# EasyEDA Pro project 21届智能车+蚂蚁搬家+主驱一体PCB文件.epro, board PCB3
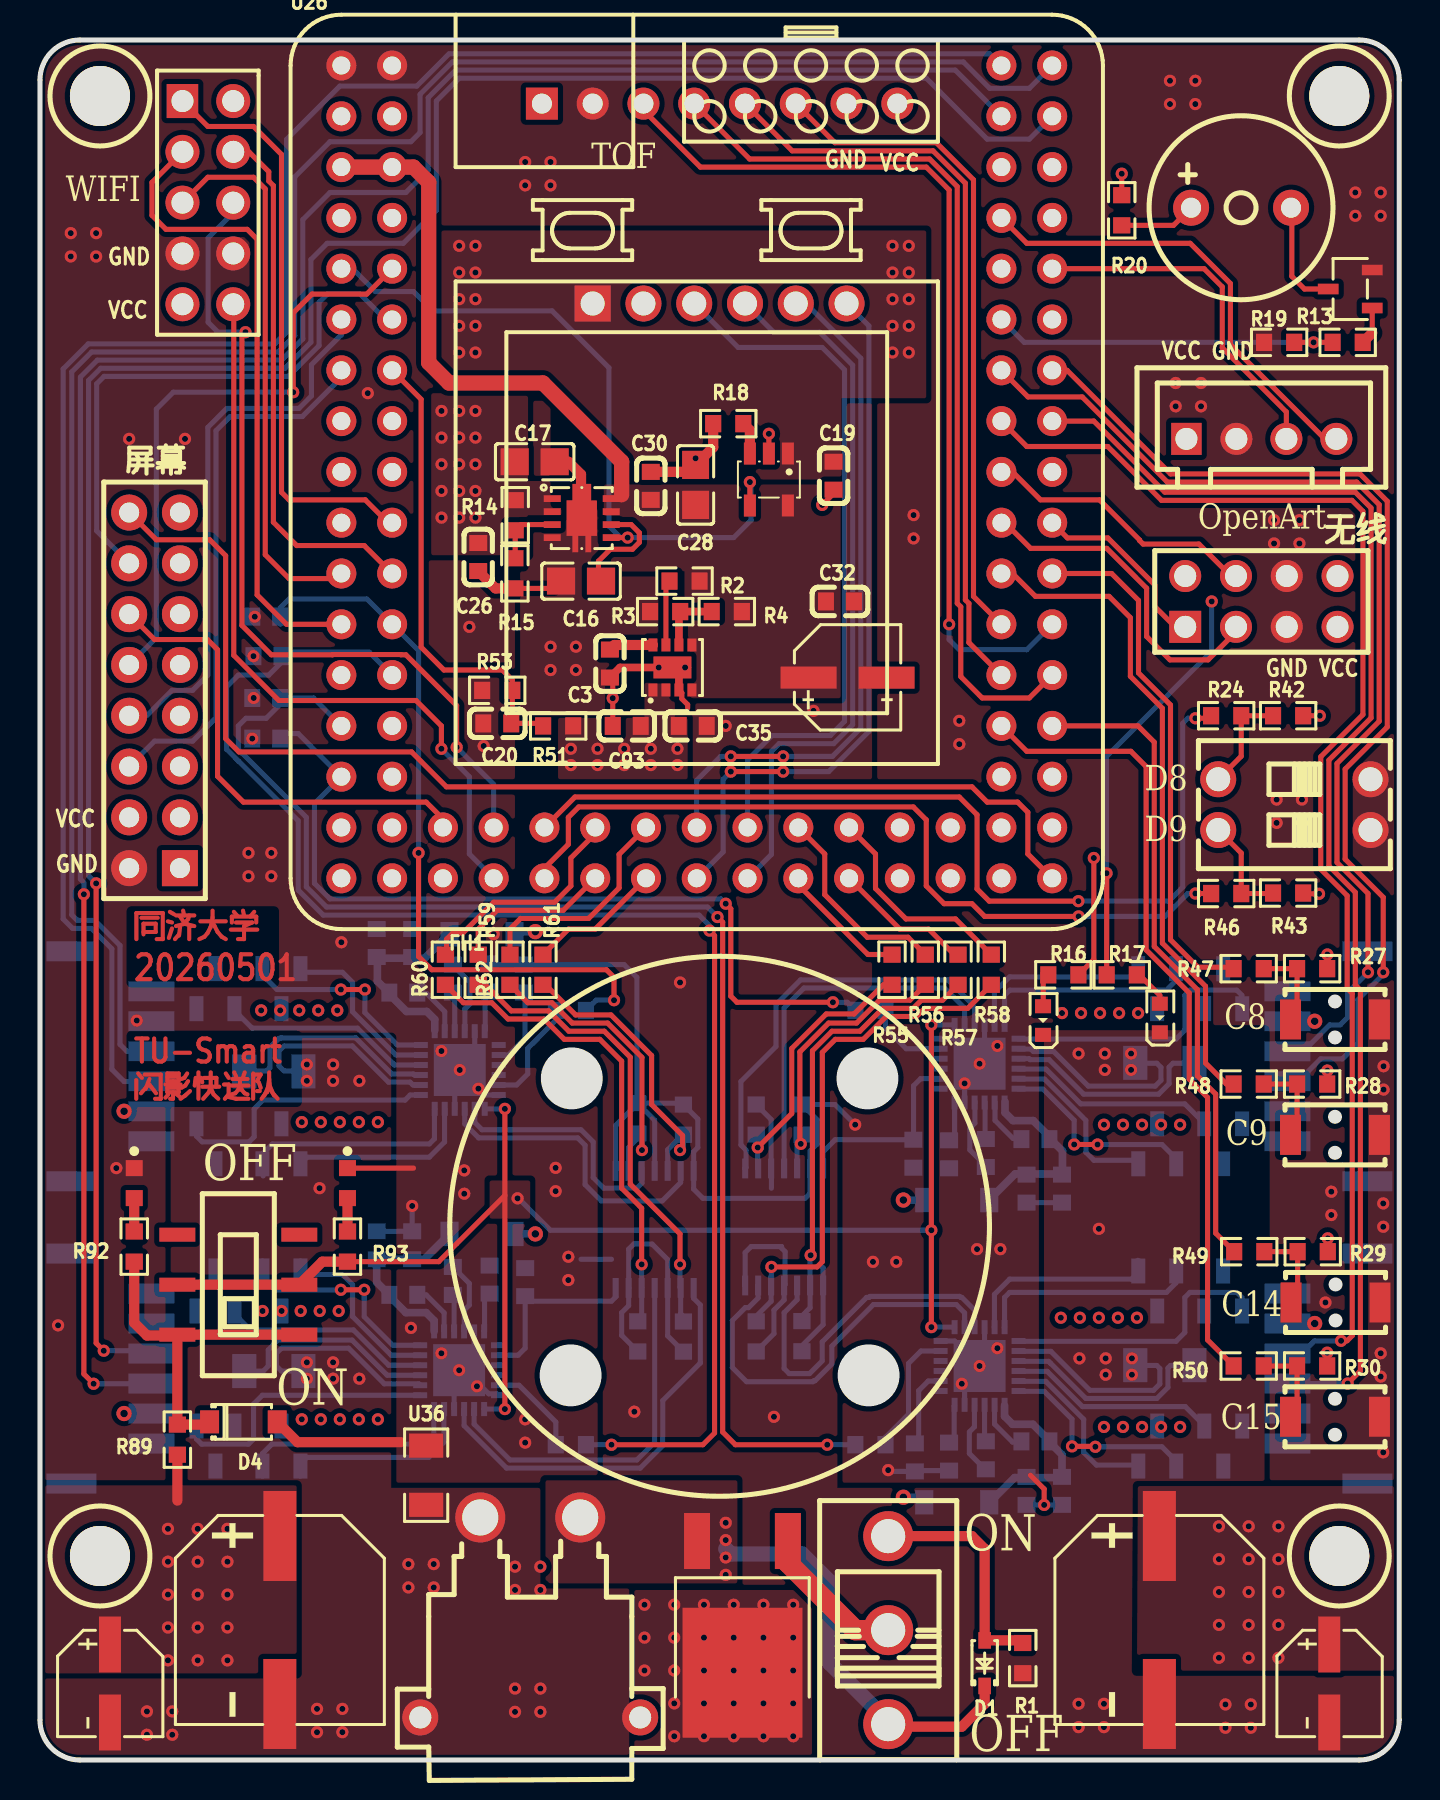
[diagram p35: board, top side]
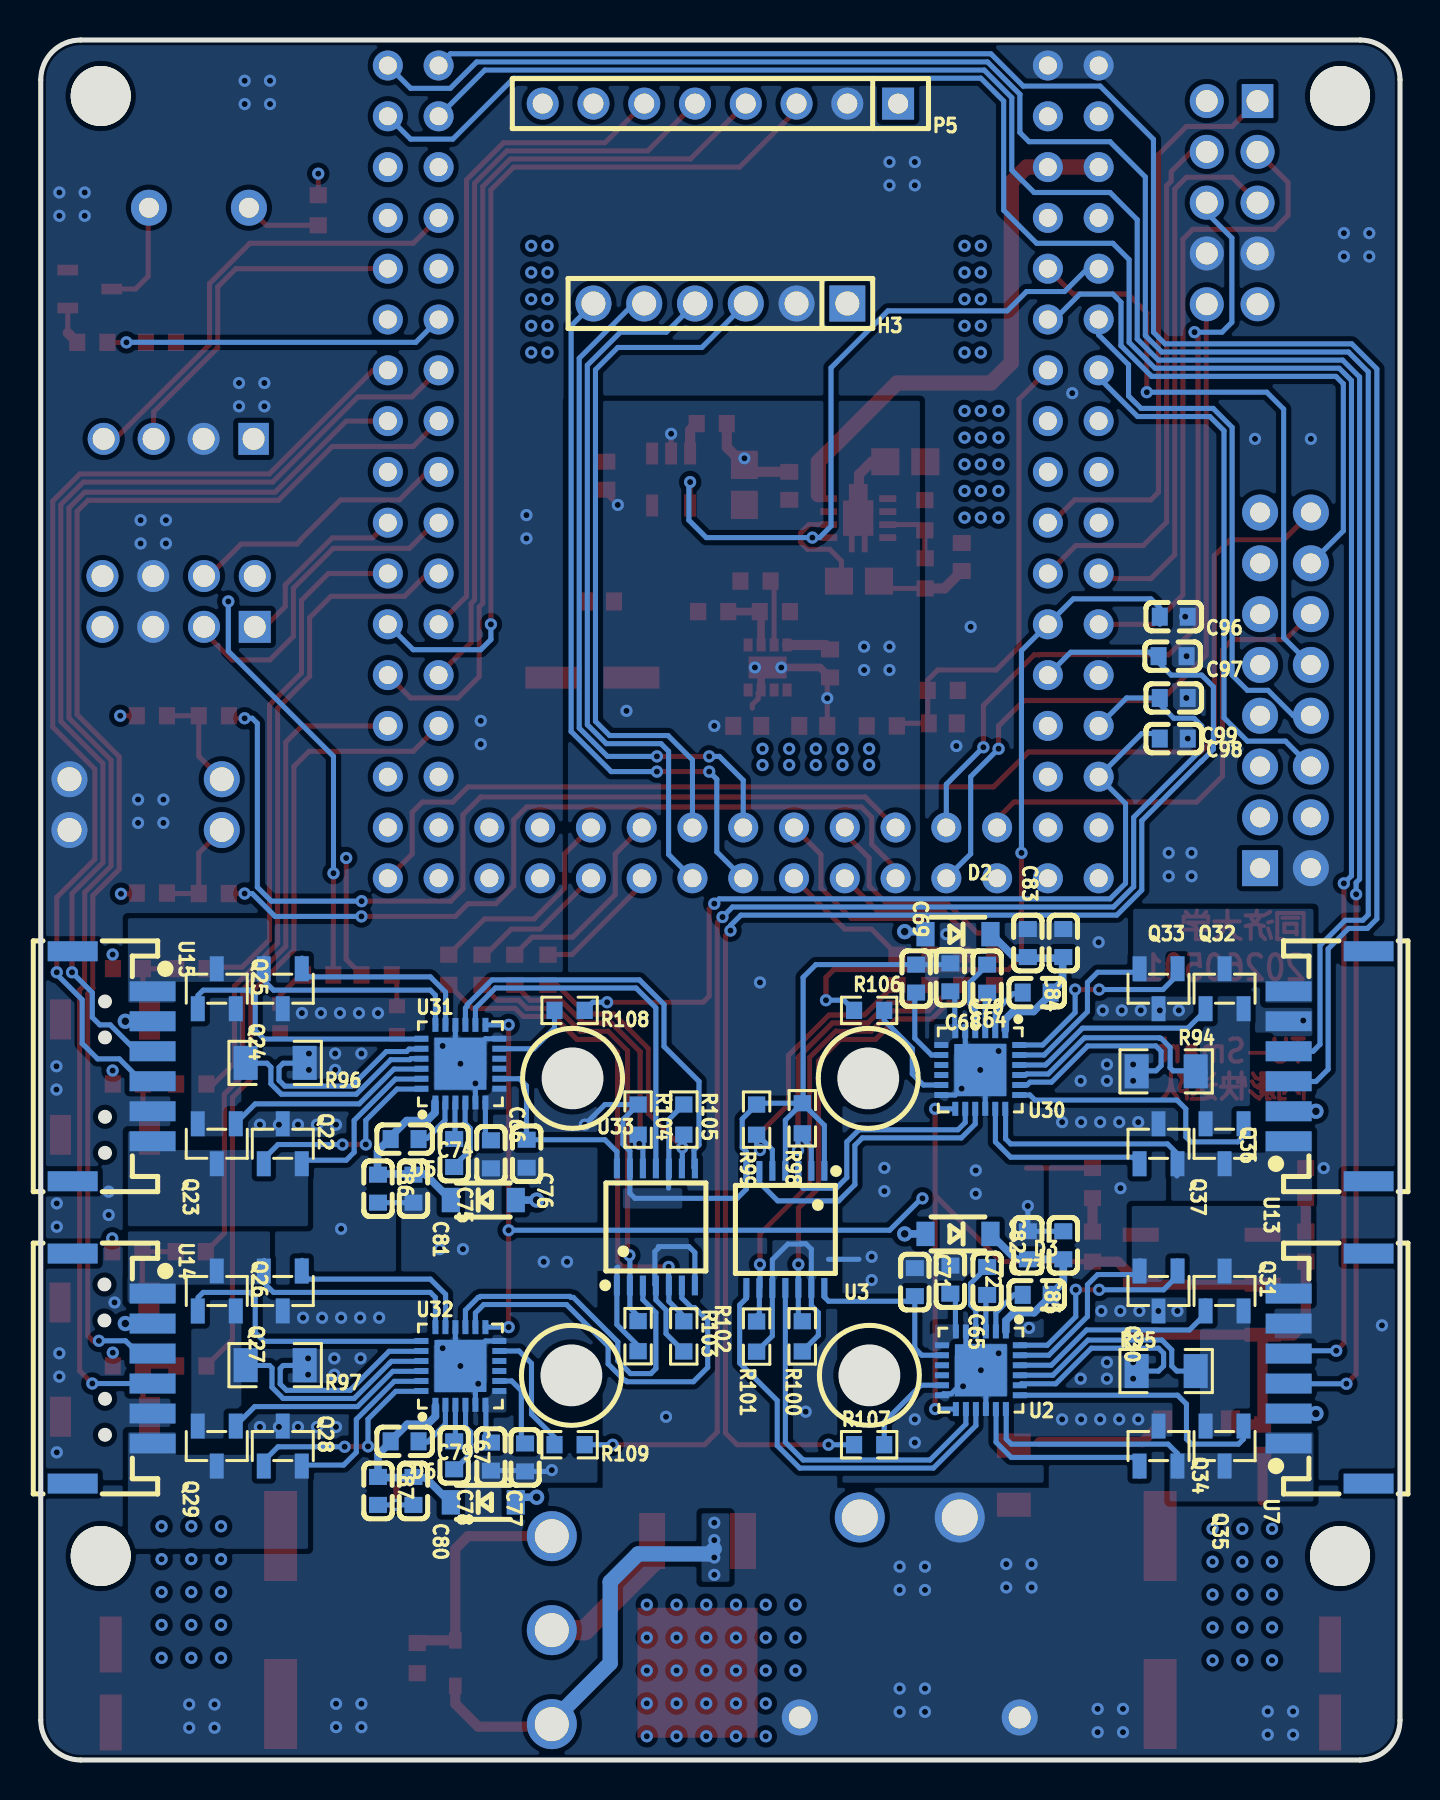
[diagram p36: board, bottom side, seen from below]

Outline 68 x 86 mm; copper layers: Top Layer, GND, POWER, Bottom Layer. Coordinates in mm from the lower left corner of the outline.
Outline path: 0,84 0,2 arc(0.59,0.59) 2,0 66,0 arc(67.41,0.59) 68,2 68,84 arc(67.41,85.41) 66,86 2,86 arc(0.59,85.41) 0,84
Stack: Top Layer 0.035mm 外层铜厚1oz / Dielectric1 0.2104mm 7628 RC49% 8.6mil / GND 0.0152mm 内层铜厚 / Dielectric2 1.065mm 1.1mm H/HOZ Copper / POWER 0.0152mm 内层铜厚 / Dielectric3 0.2104mm 7628 RC49% 8.6mil / Bottom Layer 0.035mm 外层铜厚1oz

## Design rules (mm)
spacing copperThickness1oz (default): track to track 0.152, other pairs 0.152 to 0.3
spacing copperThickness2oz: track to track 0.203, other pairs 0.152 to 0.3
spacing Plane_innerPlane: track to track 0.152, other pairs 0.152 to 0.3
spacing Copper_copperRegion: track to track 0.152, other pairs 0.152 to 0.3
spacing Copper_copperRegion1: track to track 0.152, other pairs 0.152 to 0.3
spacing Copper_copperRegion2: track to track 0.152, other pairs 0.152 to 0.3
track width copperThickness1oz (default): min 0.127, default 0.254, max 2.54
track width copperThickness2oz: min 0.203, default 0.254, max 2.54
differential pair differentialPair (default): width min 0.127, default 0.254, max 2.54; gap min 0.152, default 0.152
net PGND uses copperRegion2
pour e1732 uses Copper_copperRegion1, copperRegion1_Copper_copperRegion1
pour e1734 uses Copper_copperRegion1, copperRegion1_Copper_copperRegion1
pour e1736 uses Copper_copperRegion1, copperRegion1_Copper_copperRegion1
pour e1738 uses Copper_copperRegion1, copperRegion1_Copper_copperRegion1
pour e1740 uses Copper_copperRegion1, copperRegion1_Copper_copperRegion1
pour e1742 uses Copper_copperRegion1, copperRegion1_Copper_copperRegion1
pour e1744 uses Copper_copperRegion1, copperRegion1_Copper_copperRegion1
pour e1746 uses Copper_copperRegion1, copperRegion1_Copper_copperRegion1
pour e1748 uses Copper_copperRegion1, copperRegion1_Copper_copperRegion1
pour e1750 uses Copper_copperRegion1, copperRegion1_Copper_copperRegion1
pour e1752 uses Copper_copperRegion1, copperRegion1_Copper_copperRegion1
pour e1754 uses Copper_copperRegion1, copperRegion1_Copper_copperRegion1
pour e1756 uses Copper_copperRegion1, copperRegion1_Copper_copperRegion1
pour e1758 uses Copper_copperRegion1, copperRegion1_Copper_copperRegion1
pour e1760 uses Copper_copperRegion1, copperRegion1_Copper_copperRegion1
pour e1762 uses Copper_copperRegion1, copperRegion1_Copper_copperRegion1
pour e1764 uses Copper_copperRegion1, copperRegion1_Copper_copperRegion1
pour e1766 uses Copper_copperRegion1, copperRegion1_Copper_copperRegion1
pour e1768 uses Copper_copperRegion1, copperRegion1_Copper_copperRegion1
pour e1770 uses Copper_copperRegion1, copperRegion1_Copper_copperRegion1
pour e1772 uses Copper_copperRegion1, copperRegion1_Copper_copperRegion1
pour e1774 uses Copper_copperRegion1, copperRegion1_Copper_copperRegion1
pour e1776 uses Copper_copperRegion1, copperRegion1_Copper_copperRegion1
pour e1778 uses Copper_copperRegion1, copperRegion1_Copper_copperRegion1
pour e1780 uses Copper_copperRegion1, copperRegion1_Copper_copperRegion1
pour e1782 uses Copper_copperRegion2, copperRegion1_Copper_copperRegion2
pour e1784 uses Copper_copperRegion2, copperRegion1_Copper_copperRegion2
pour e1786 uses Copper_copperRegion2, copperRegion1_Copper_copperRegion2
pour e1788 uses Copper_copperRegion2, copperRegion1_Copper_copperRegion2
pour e1790 uses Copper_copperRegion1, copperRegion1_Copper_copperRegion1
pour e1792 uses Copper_copperRegion1, copperRegion1_Copper_copperRegion1
pour e1794 uses Copper_copperRegion1, copperRegion1_Copper_copperRegion1
pour e1796 uses Copper_copperRegion1, copperRegion1_Copper_copperRegion1
pour e1798 uses Copper_copperRegion1, copperRegion1_Copper_copperRegion1
pour e1800 uses Copper_copperRegion1, copperRegion1_Copper_copperRegion1
pour e1802 uses Copper_copperRegion1, copperRegion1_Copper_copperRegion1
pour e1804 uses Copper_copperRegion1, copperRegion1_Copper_copperRegion1
pour e1806 uses Copper_copperRegion1, copperRegion1_Copper_copperRegion1
pour e1808 uses Copper_copperRegion1, copperRegion1_Copper_copperRegion1
pour e1810 uses Copper_copperRegion1, copperRegion1_Copper_copperRegion1
pour e1812 uses Copper_copperRegion1, copperRegion1_Copper_copperRegion1
pour e1814 uses Copper_copperRegion1, copperRegion1_Copper_copperRegion1
pour e1816 uses Copper_copperRegion1, copperRegion1_Copper_copperRegion1
pour e1818 uses Copper_copperRegion2, copperRegion1_Copper_copperRegion2
pour e1820 uses Copper_copperRegion1, copperRegion1_Copper_copperRegion1
pour e1822 uses Copper_copperRegion2, copperRegion1_Copper_copperRegion2
pour e1832 uses Copper_copperRegion2, copperRegion1_Copper_copperRegion2
pour e1843 uses Copper_copperRegion1, copperRegion1_Copper_copperRegion1
pour e1859 uses Copper_copperRegion1, copperRegion1_Copper_copperRegion1
pour e1888 uses Copper_copperRegion1, copperRegion1_Copper_copperRegion1
pour e1890 uses Copper_copperRegion1, copperRegion1_Copper_copperRegion1
pour e1892 uses Copper_copperRegion1, copperRegion1_Copper_copperRegion1

## Placement (name value [footprint] x y rotation side)
BUZZER1  3kHz  [BUZ-TH_BD9.0-P5.00-D0.6-FD]  60.09 77.61 0 top
C3  430pF  [C0603]  28.51 54.82 270 top
C16  10nF  [C0805]  27.07 58.94 0 top
C17  4.7uF  [C0805]  24.75 64.91 180 top
C19  100nF  [C0603]  39.7 64.22 90 top
C20  100nF  [C0603]  22.88 51.83 0 top
C21  47uF  [CAP-SMD_BD5.0-L5.3-W5.3-LS5.9-FD]  40.4 54.12 0 top
C26  100nF  [C0603]  21.92 60.15 270 top
C28  10uF  [C0805]  32.8 63.75 90 top
C30  100nF  [C0603]  30.56 63.71 90 top
C32  100nF  [C0603]  40.02 57.93 0 top
C35  100nF  [C0603]  32.66 51.7 180 top
C58  47uF  [CAP-SMD_BD5.0-L5.3-W5.3-LS5.9-FD]  64.5 3.83 270 top
C59  47uF  [CAP-SMD_BD5.0-L5.3-W5.3-LS5.9-FD]  3.5 3.83 270 top
C64  100nF  [C0603]  20.66 39.07 90 bottom
C65  100nF  [C0603]  20.66 23.95 90 bottom
C66  100nF  [C0603]  47.32 30.35 270 bottom
C67  100nF  [C0603]  47.32 15.24 270 bottom
C68  1uF  [C0603]  22.5 39.13 270 bottom
C69  1uF  [C0603]  24.21 39.07 270 bottom
C70  1uF  [C0603]  18.18 38.37 180 bottom
C71  1uF  [C0603]  24.27 23.89 270 bottom
C72  1uF  [C0603]  22.5 24.02 270 bottom
C73  1uF  [C0603]  18.18 23.26 180 bottom
C74  1uF  [C0603]  49.8 31.05 0 bottom
C75  1uF  [C0603]  45.48 30.28 90 bottom
C76  1uF  [C0603]  43.69 30.31 90 bottom
C77  1uF  [C0603]  43.77 15.13 90 bottom
C78  1uF  [C0603]  45.48 15.17 90 bottom
C79  1uF  [C0603]  49.8 15.93 0 bottom
C80  100nF  [C0603]  49.35 13.45 90 bottom
C81  100nF  [C0603]  49.35 28.57 90 bottom
C82  100nF  [C0603]  18.62 25.73 270 bottom
C83  100nF  [C0603]  18.62 40.85 270 bottom
C84  10uF  [C0603]  16.84 40.85 90 bottom
C85  10uF  [C0603]  16.84 25.73 90 bottom
C86  10uF  [C0603]  51.13 28.57 270 bottom
C87  10uF  [C0603]  51.13 13.45 270 bottom
C93  10uF  [C0603]  29.35 51.7 0 top
C94  470uF  [CAP-SMD_BD10.0-L10.3-W10.3-LS11.0]  56 7 270 top
C95  470uF  [CAP-SMD_BD10.0-L10.3-W10.3-LS11.0]  12 7 270 top
C96  1uF  [C0603]  11.32 57.17 0 bottom
C97  1uF  [C0603]  11.38 55.19 0 bottom
C98  1uF  [C0603]  11.32 51.07 0 bottom
C99  1uF  [C0603]  11.32 53.1 0 bottom
CN1  HC-PM254-8.5H-2x5PZ  [HDR-TH_10P-P2.54-V-F-R2-C5-S2.54-1]  8.4 77.87 270 top
CN2  ZX-XH2.54-4PZZ  [CONN-TH_4P-P2.50_4PIN]  61.1 66.06 0 top
CN3  XT30PW-M30.G.Y  [CONN-TH_XT30PW-M]  24.53 7.13 0 top
D1  BZT52C16S  [SOD-323_L1.7-W1.3-LS2.6-RD]  47.26 4.84 90 top
D2  1N5819W  [SOD-123_L2.7-W1.6-LS3.7-R-RD]  22.11 41.29 0 bottom
D3  1N5819W  [SOD-123_L2.7-W1.6-LS3.7-R-RD]  22.11 26.31 0 bottom
D4  BZT52C3V3  [SOD-123_L2.8-W1.8-LS3.7-RD]  10.18 16.91 0 top
D5  1N5819W  [SOD-123_L2.7-W1.6-LS3.7-R-RD]  45.86 28 180 bottom
D6  1N5819W  [SOD-123_L2.7-W1.6-LS3.7-R-RD]  45.86 12.88 180 bottom
FH1  智能车逐飞摄像头固定孔  [智能车逐飞摄像头支架固定孔]  34 26.69 0 top
H3  2.54-1x6P直针  [HDR-TH_6P-P2.54-V-M-1]  34 72.83 0 bottom
J1  2.54-2*8P母  [HDR-TH_16P-P2.54-V-F-R2-C8-S2.54]  5.73 53.48 90 top
LED1  Blue  [LEDC1608(0603)]  15.38 28.84 270 top
LED2  =Color  [LEDC1608(0603)]  4.72 28.84 270 top
NOREF  -  [Pad_e372]  3 83.2 0 top
NOREF#2  -  [Pad_e374]  3 10.2 0 top
NOREF#3  -  [Pad_e373]  65 83.2 0 top
NOREF#4  -  [Pad_e375]  65 10.2 0 top
P5  2.54-1*8P母环保  [HDR-TH_8P-P2.54-V-F_2]  34 82.82 0 bottom
Q1  HY19P03D  [TO-252-2_L6.6-W6.1-P4.57-LS9.9-TL-CW]  35.14 7.66 270 top
Q10  S8050 J3Y(RANGE:200-350)  [SOT-23-3_L3.0-W1.7-P0.95-LS2.9-BR]  65.55 73.55 0 top
Q22  AO3400A  [SOT-23-3_L2.9-W1.3-P1.90-LS2.4-BR]  55.89 30.81 270 bottom
Q23  AO3400A  [SOT-23-3_L2.9-W1.3-P1.90-LS2.4-BR]  59.19 30.81 90 bottom
Q24  AO3400A  [SOT-23-3_L2.9-W1.3-P1.90-LS2.4-BR]  55.89 38.56 90 bottom
Q25  AO3400A  [SOT-23-3_L2.9-W1.3-P1.90-LS2.4-BR]  59.19 38.56 270 bottom
Q26  AO3400A  [SOT-23-3_L2.9-W1.3-P1.90-LS2.4-BR]  59.19 23.45 270 bottom
Q27  AO3400A  [SOT-23-3_L2.9-W1.3-P1.90-LS2.4-BR]  55.89 23.45 90 bottom
Q28  AO3400A  [SOT-23-3_L2.9-W1.3-P1.90-LS2.4-BR]  55.89 15.7 270 bottom
Q29  AO3400A  [SOT-23-3_L2.9-W1.3-P1.90-LS2.4-BR]  59.19 15.7 90 bottom
Q30  AO3400A  [SOT-23-3_L2.9-W1.3-P1.90-LS2.4-BR]  12.08 23.45 90 bottom
Q31  AO3400A  [SOT-23-3_L2.9-W1.3-P1.90-LS2.4-BR]  8.78 23.45 270 bottom
Q32  AO3400A  [SOT-23-3_L2.9-W1.3-P1.90-LS2.4-BR]  8.78 38.56 270 bottom
Q33  AO3400A  [SOT-23-3_L2.9-W1.3-P1.90-LS2.4-BR]  12.08 38.56 90 bottom
Q34  AO3400A  [SOT-23-3_L2.9-W1.3-P1.90-LS2.4-BR]  12.08 15.7 270 bottom
Q35  AO3400A  [SOT-23-3_L2.9-W1.3-P1.90-LS2.4-BR]  8.78 15.7 90 bottom
Q36  AO3400A  [SOT-23-3_L2.9-W1.3-P1.90-LS2.4-BR]  12.08 30.81 270 bottom
Q37  AO3400A  [SOT-23-3_L2.9-W1.3-P1.90-LS2.4-BR]  8.78 30.81 90 bottom
R1  10kΩ  [R0603]  49.16 5.1 90 top
R2  100kΩ  [R0603]  32.25 58.95 180 top
R3  100kΩ  [R0603]  31.28 57.42 180 top
R4  523kΩ  [R0603]  34.36 57.42 180 top
R13  4.7kΩ  [R0603]  65.42 70.88 180 top
R14  30.9kΩ  [R0603]  23.77 62.24 90 top
R15  10kΩ  [R0603]  23.76 59.33 90 top
R16  2.7kΩ  [R0603]  51.2 39.26 0 top
R17  10kΩ  [R0603]  54.12 39.26 180 top
R18  4.7kΩ  [R0603]  34.43 66.82 0 top
R19  1kΩ  [R0603]  61.99 70.88 180 top
R20  10Ω  [R0603]  54.12 77.49 270 top
R24  100Ω  [R0603]  59.34 52.21 180 top
R27  4.7kΩ  [R0603]  63.64 39.57 0 top
R28  4.7kΩ  [R0603]  63.64 33.8 0 top
R29  4.7kΩ  [R0603]  63.67 25.42 0 top
R30  4.7kΩ  [R0603]  63.64 19.7 0 top
R42  4.7kΩ  [R0603]  62.44 52.21 0 top
R43  4.7kΩ  [R0603]  62.44 43.35 0 top
R46  100Ω  [R0603]  59.34 43.32 180 top
R47  100Ω  [R0603]  60.47 39.57 180 top
R48  100Ω  [R0603]  60.47 33.8 180 top
R49  100Ω  [R0603]  60.5 25.42 180 top
R50  100Ω  [R0603]  60.47 19.7 180 top
R51  10kΩ  [R0603]  25.92 51.7 180 top
R53  1kΩ  [R0603]  22.88 53.48 180 top
R55  100Ω  [R0603]  42.63 39.51 270 top
R56  100Ω  [R0603]  44.29 39.51 90 top
R57  100Ω  [R0603]  45.93 39.51 270 top
R58  100Ω  [R0603]  47.59 39.51 90 top
R59  100Ω  [R0603]  21.92 39.51 270 top
R60  100Ω  [R0603]  20.28 39.51 90 top
R61  100Ω  [R0603]  25.16 39.51 270 top
R62  100Ω  [R0603]  23.51 39.51 90 top
R89  2.2kΩ  [R0603]  6.87 16.02 90 top
R92  1kΩ  [R0603]  4.72 25.67 270 top
R93  330Ω  [R0603]  15.38 25.67 90 top
R94  100mΩ  [R1206]  11.7 34.43 180 bottom
R95  100mΩ  [R1206]  11.7 19.45 180 bottom
R96  100mΩ  [R1206]  56.27 34.86 0 bottom
R97  100mΩ  [R1206]  56.27 19.74 0 bottom
R98  10kΩ  [R0603]  29.9 32.09 90 bottom
R99  10kΩ  [R0603]  32.19 32.02 90 bottom
R100  10kΩ  [R0603]  29.9 21.18 90 bottom
R101  10kΩ  [R0603]  32.19 21.17 90 bottom
R102  10kΩ  [R0603]  38.12 21.19 270 bottom
R103  10kΩ  [R0603]  35.83 21.18 270 bottom
R104  10kΩ  [R0603]  38.12 32.02 270 bottom
R105  10kΩ  [R0603]  35.83 32.02 270 bottom
R106  1kΩ  [R0603]  26.56 37.48 180 bottom
R107  1kΩ  [R0603]  26.56 15.76 180 bottom
R108  1kΩ  [R0603]  41.54 37.48 0 bottom
R109  1kΩ  [R0603]  41.54 15.76 0 bottom
SW2  SS-12D10L5R  [SW-TH_SS-12D10L9]  42.43 6.49 90 top
SW3  DSWB02LHGET  [SW-TH_DSWB02LHGET]  62.75 47.77 90 top
U2  DRV8701E  [VQFN-24_L4.0-W4.0-P0.50-BL-EP2.5]  20.97 19.49 0 bottom
U3  SN74HC125PWR  [TSSOP-14_L5.0-W4.4-P0.65-LS6.5-BL]  30.75 26.53 0 bottom
U5  SS-3235S-L1  [SW-SMD_SS-3235S-LX]  9.92 23.77 270 top
U7  ZX-ZH1.5-6PWT  [CONN-SMD_6P-P1.50_ZX-ZH1.5-6PWT]  3.57 19.57 90 bottom
U8  ZX-QC34-2TPDZ  [KEY-SMD_L3.9-W3.0-LS5.0-EH]  64.79 37.03 0 top
U9  ZX-QC34-2TPDZ  [KEY-SMD_L3.9-W3.0-LS5.0-EH]  64.79 31.26 0 top
U10  ZX-QC34-2TPDZ  [KEY-SMD_L3.9-W3.0-LS5.0-EH]  64.81 22.88 0 top
U11  ZX-QC34-2TPDZ  [KEY-SMD_L3.9-W3.0-LS5.0-EH]  64.79 17.16 0 top
U12  TPS82130SILR  [USIP-8_L3.0-W2.8-P0.65-TL-EP]  31.64 54.63 90 top
U13  ZX-ZH1.5-6PWT  [CONN-SMD_6P-P1.50_ZX-ZH1.5-6PWT]  3.57 34.69 90 bottom
U14  ZX-ZH1.5-6PWT  [CONN-SMD_6P-P1.50_ZX-ZH1.5-6PWT]  64.41 19.57 270 bottom
U15  ZX-ZH1.5-6PWT  [CONN-SMD_6P-P1.50_ZX-ZH1.5-6PWT]  64.41 34.69 270 bottom
U19  TPS7A8001DRBR  [VSON-8_L3.0-W3.0-P0.65-TL-EP]  27.1 62.1 0 top
U20  42-51/GHC-YW2X2K/3T  [LED-SMD_L1.6-W0.8-FD_GREEN-1]  50.18 36.97 270 top
U21  SY6280AAC  [SOT-23-5_L3.0-W1.7-P0.95-LS2.8-BR]  36.47 64.02 90 top
U22  42-51/GHC-YW2X2K/3T  [LED-SMD_L1.6-W0.8-FD_GREEN-1]  56.02 37.1 270 top
U25  HC-PM254-8.5H-2x4PZ-02A  [HDR-TH_8P-P2.54-V-F-R2-C4-S2.54]  61.1 57.93 0 top
U26  MIMXRT1021xAGxA_CoreBoard  [MIMXRT1021xAGxA_CoreBoard_V2.x]  32.86 64.41 0 top
U30  DRV8701E  [VQFN-24_L4.0-W4.0-P0.50-BL-EP2.5]  21 34.5 0 bottom
U31  DRV8701E  [VQFN-24_L4.0-W4.0-P0.50-BL-EP2.5]  47.01 34.81 180 bottom
U32  DRV8701E  [VQFN-24_L4.0-W4.0-P0.50-BL-EP2.5]  47.01 19.7 180 bottom
U33  SN74HC125PWR  [TSSOP-14_L5.0-W4.4-P0.65-LS6.5-BL]  37.23 26.65 180 bottom
U36  0Ω  [R1206]  19.32 14.24 270 top

## Footprints (pads in the part's own frame, mm; a bottom-side part is the same pattern mirrored in y, then rotated)
BUZ-TH_BD9.0-P5.00-D0.6-FD
  round 1.8 hole 1: 1(-2.5,0) 2(2.5,0)
C0603
  rect 0.8x0.9 smd: 1(-0.7,0) 2(0.7,0)
C0805
  rect 1.41x1.35 smd: 1(-1,0) 2(1,0)
CAP-SMD_BD5.0-L5.3-W5.3-LS5.9-FD
  rect 2.8x1.1 smd: 1(-1.95,0) 2(1.95,0)
CAP-SMD_BD10.0-L10.3-W10.3-LS11.0
  rect 4.5x1.65 smd: 1(-4.2,0) 2(4.2,0)
CONN-SMD_6P-P1.50_ZX-ZH1.5-6PWT
  rect 1x2.3 smd: 1(-3.75,2) 2(-2.25,2) 3(-0.75,2) 4(0.75,2) 5(2.25,2) 6(3.75,2)
  rect 1x2.5 smd: 7(5.75,-2) 8(-5.75,-2)
CONN-TH_4P-P2.50_4PIN
  rect 1.524x1.6 hole 1.1: 1(-3.75,0)
  round 1.6 hole 1.1: 2(-1.25,0) 3(1.25,0) 4(3.75,0)
CONN-TH_XT30PW-M
  round 2.5 hole 1.8: 1(-2.5,5) 2(2.5,5)
  round 1.8 hole 1.1: 3(5.5,-5) 4(-5.5,-5)
HDR-TH_6P-P2.54-V-M-1
  rect 1.8x1.8 hole 1.2: 1(-6.35,0)
  round 1.8 hole 1.2: 2(-3.81,0) 3(-1.27,0) 4(1.27,0) 5(3.81,0) 6(6.35,0)
HDR-TH_8P-P2.54-V-F-R2-C4-S2.54
  rect 1.6x1.6 hole 1.1: 1(-3.81,-1.27)
  round 1.6 hole 1.1: 2(-3.81,1.27) 3(-1.27,-1.27) 4(-1.27,1.27) 5(1.27,-1.27) 6(1.27,1.27) 7(3.81,-1.27) 8(3.81,1.27)
HDR-TH_8P-P2.54-V-F_2
  rect 1.6x1.6 hole 1: 1(-8.89,0)
  round 1.6 hole 1: 2(-6.35,0) 3(-3.81,0) 4(-1.27,0) 5(1.27,0) 6(3.81,0) 7(6.35,0) 8(8.89,0)
HDR-TH_10P-P2.54-V-F-R2-C5-S2.54-1
  rect 1.7x1.575 hole 1.1: 1(-5.08,-1.27)
  round 1.7 hole 1.1: 2(-5.08,1.27) 3(-2.54,-1.27) 4(-2.54,1.27) 5(0,-1.27) 6(0,1.27) 7(2.54,-1.27) 8(2.54,1.27) 9(5.08,-1.27) 10(5.08,1.27)
HDR-TH_16P-P2.54-V-F-R2-C8-S2.54
  rect 1.8x1.8 hole 1: 1(-8.89,-1.27)
  round 1.8 hole 1: 2(-8.89,1.27) 3(-6.35,-1.27) 4(-6.35,1.27) 5(-3.81,-1.27) 6(-3.81,1.27) 7(-1.27,-1.27) 8(-1.27,1.27) 9(1.27,-1.27) 10(1.27,1.27) 11(3.81,-1.27) 12(3.81,1.27) 13(6.35,-1.27) 14(6.35,1.27) 15(8.89,-1.27) 16(8.89,1.27)
KEY-SMD_L3.9-W3.0-LS5.0-EH
  rect 1.05x2 smd: 1(-2.225,0) 2(2.225,0)
LED-SMD_L1.6-W0.8-FD_GREEN-1
  rect 0.7x0.8 smd: 1(-0.715,0) 2(0.715,0)
LEDC1608(0603)
  rect 0.8x0.85 smd: A(0.75,0) C(-0.75,0)
MIMXRT1021xAGxA_CoreBoard_V2.x
  round 1.5 hole 0.9: 1(-17.78,20.32) 2(-15.24,20.32) 3(-17.78,17.78) 4(-15.24,17.78) 5(-17.78,15.24) 6(-15.24,15.24) 7(-17.78,12.7) 8(-15.24,12.7) 9(-17.78,10.16) 10(-15.24,10.16) 11(-17.78,7.62) 12(-15.24,7.62) 13(-17.78,5.08) 14(-15.24,5.08) 15(-17.78,2.54) 16(-15.24,2.54) 17(-17.78,0) 18(-15.24,0) 19(-17.78,-2.54) 20(-15.24,-2.54) 21(-17.78,-5.08) 22(-15.24,-5.08) 23(-17.78,-7.62) 24(-15.24,-7.62) 25(-17.78,-10.16) 26(-15.24,-10.16) 27(-17.78,-12.7) 28(-15.24,-12.7) 29(-17.78,-15.24) 30(-15.24,-15.24) 31(-17.78,-20.32) 32(-17.78,-17.78) 33(-15.24,-20.32) 34(-15.24,-17.78) 35(-12.7,-20.32) 36(-12.7,-17.78) 37(-10.16,-20.32) 38(-10.16,-17.78) 39(-7.62,-20.32) 40(-7.62,-17.78) 41(-5.08,-20.32) 42(-5.08,-17.78) 43(-2.54,-20.32) 44(-2.54,-17.78) 45(0,-20.32) 46(0,-17.78) 47(2.54,-20.32) 48(2.54,-17.78) 49(5.08,-20.32) 50(5.08,-17.78) 51(7.62,-20.32) 52(7.62,-17.78) 53(10.16,-20.32) 54(10.16,-17.78) 55(12.7,-20.32) 56(12.7,-17.78) 57(15.24,-20.32) 58(15.24,-17.78) 59(17.78,-20.32) 60(17.78,-17.78) 61(15.24,-15.24) 62(17.78,-15.24) 63(15.24,-12.7) 64(17.78,-12.7) 65(15.24,-10.16) 66(17.78,-10.16) 67(15.24,-7.62) 68(17.78,-7.62) 69(15.24,-5.08) 70(17.78,-5.08) 71(15.24,-2.54) 72(17.78,-2.54) 73(15.24,0) 74(17.78,0) 75(15.24,2.54) 76(17.78,2.54) 77(15.24,5.08) 78(17.78,5.08) 79(15.24,7.62) 80(17.78,7.62) 81(15.24,10.16) 82(17.78,10.16) 83(15.24,12.7) 84(17.78,12.7) 85(15.24,15.24) 86(17.78,15.24) 87(15.24,17.78) 88(17.78,17.78) 89(15.24,20.32) 90(17.78,20.32)
Pad_e372
  round 3 hole 3: 1(0,0)
Pad_e373
  round 3 hole 3: 1(0,0)
Pad_e374
  round 3 hole 3: 1(0,0)
Pad_e375
  round 3 hole 3: 1(0,0)
R0603
  rect 0.806x0.864 smd: 1(-0.753,0) 2(0.753,0)
R1206
  rect 1.208x1.701 smd: 1(-1.479,0) 2(1.479,0)
SOD-123_L2.7-W1.6-LS3.7-R-RD
  rect 0.909x1.219 smd: 1(1.625,0) 2(-1.625,0)
SOD-123_L2.8-W1.8-LS3.7-RD
  rect 0.95x1.15 smd: 1(-1.692,0) 2(1.692,0)
SOD-323_L1.7-W1.3-LS2.6-RD
  rect 0.83x0.63 smd: 1(-1.14,0) 2(1.14,0)
SOT-23-3_L2.9-W1.3-P1.90-LS2.4-BR
  rect 1.25x0.7 smd: 1(1,-0.95) 2(1,0.95) 3(-1,0)
SOT-23-3_L3.0-W1.7-P0.95-LS2.9-BR
  rect 1.038x0.532 smd: 1(1.101,-0.95) 2(1.101,0.95) 3(-1.101,0)
SOT-23-5_L3.0-W1.7-P0.95-LS2.8-BR
  rect 1.1x0.6 smd: 1(1.3,-0.95) 2(1.3,0) 3(1.3,0.95) 4(-1.3,0.95) 5(-1.3,-0.95)
SW-SMD_SS-3235S-LX
  rect 0.7x1.8 smd: 1(-2.5,3.05) 2(0,3.05) 3(2.5,3.05) 4(-2.5,-3.05) 5(0,-3.05) 6(2.5,-3.05)
SW-TH_DSWB02LHGET
  round 1.8 hole 1.2: 1(-1.27,3.81) 2(1.27,3.81) 3(-1.27,-3.81) 4(1.27,-3.81)
SW-TH_SS-12D10L9
  round 2.5 hole 1.7: 1(-4.7,0) 2(0,0) 3(4.7,0)
TO-252-2_L6.6-W6.1-P4.57-LS9.9-TL-CW
  rect 2.8x1.3 smd: 1(-3.292,2.273) 3(-3.292,-2.273)
  rect 6.5x6 smd: 2(3.292,0)
TSSOP-14_L5.0-W4.4-P0.65-LS6.5-BL
  rect 0.305x0.991 smd: 1(-1.95,-2.925) 2(-1.3,-2.925) 3(-0.65,-2.925) 4(0,-2.925) 5(0.65,-2.925) 6(1.3,-2.925) 7(1.95,-2.925) 8(1.95,2.925) 9(1.3,2.925) 10(0.65,2.925) 11(0,2.925) 12(-0.65,2.925) 13(-1.3,2.925) 14(-1.95,2.925)
USIP-8_L3.0-W2.8-P0.65-TL-EP
  rect 0.65x0.45 smd: 1(-1.125,0.975) 2(-1.125,0.325) 3(-1.125,-0.325) 4(-1.125,-0.975) 5(1.125,-0.975) 6(1.125,-0.325) 7(1.125,0.325) 8(1.125,0.975)
  rect 1.1x1.9 smd: 9(0,0)
VQFN-24_L4.0-W4.0-P0.50-BL-EP2.5
  rect 0.3x0.7 smd: 1(-1.25,-1.942) 2(-0.75,-1.942) 3(-0.25,-1.942) 4(0.25,-1.942) 5(0.75,-1.942) 6(1.25,-1.942) 13(1.25,1.942) 14(0.75,1.942) 15(0.25,1.942) 16(-0.25,1.942) 17(-0.75,1.942) 18(-1.25,1.942)
  rect 0.7x0.3 smd: 7(1.948,-1.25) 8(1.948,-0.75) 9(1.948,-0.25) 10(1.948,0.25) 11(1.948,0.75) 12(1.948,1.25) 19(-1.948,1.25) 20(-1.948,0.75) 21(-1.948,0.25) 22(-1.948,-0.25) 23(-1.948,-0.75) 24(-1.948,-1.25)
  rect 2.6x2.6 smd: 25(0.001,-0.001)
VSON-8_L3.0-W3.0-P0.65-TL-EP
  rect 0.85x0.34 smd: 1(-1.476,0.975) 2(-1.476,0.325) 3(-1.476,-0.325) 4(-1.476,-0.976) 5(1.476,-0.976) 6(1.476,-0.325) 7(1.476,0.325) 8(1.476,0.976)
  custom 1.52x3.42 smd: 9(0,-0.005)

## Nets
As in the schematic, except:
GND: C20.1 C68.1 C69.1 C71.1 C72.1 C75.1 C76.1 C77.1 C78.1 C80.1 C81.1 C82.1 C83.1 C84.2 C85.2 C86.2 C87.2 C96.1 C97.1 C98.1 C99.1 CN1.7 CN1.8 CN2.2 D4.2 H3.2 J1.2 LED1.C LED2.C P5.2 Q10.2 R19.2 R53.2 R98.2 R99.2 R100.1 R101.1 R102.2 R103.2 R104.1 R105.1 SW3.3 SW3.4 U2.5 U2.12 U2.16 U2.25 U3.1 U3.4 U3.7 U3.10 U3.13 U7.5 U8.2 U9.2 U10.2 U11.2 U13.5 U14.5 U15.5 U25.5 U25.6 U26.1 U26.2 U30.5 U30.12 U30.16 U30.25 U31.5 U31.12 U31.16 U31.25 U32.5 U32.12 U32.16 U32.25 U33.1 U33.4 U33.7 U33.10 U33.13 U36.1
L_B_PH: U2.15 U3.8
L_B_PH_IN: R59.2 R101.2 U3.9
R_F_PH: U31.15 U33.8
R_F_PH_IN: R55.2 R105.2 U33.9

Pads without a net: CN1 2; J1 1 3 5 7 9 11 13 15; NOREF 1; NOREF#2 1; NOREF#3 1; NOREF#4 1; P5 7 8; U2 9 10; U5 1 4; U7 7 8; U13 7 8; U14 7 8; U15 7 8; U25 2 8; U26 3 4 7 8 15 16 17 18 19 25 28 30 31 32 33 34 35 53 54 55 56 57 58 60 61 62 74 80 81 84 85 86; U30 9 10; U31 9 10; U32 9 10

## Via types
v1: diameter 0.61, hole 0.305, Top Layer to Bottom Layer, 365 vias
v2: diameter 0.762, hole 0.381, Top Layer to Bottom Layer, 8 vias

## Routing (per net, layer and track width the routed paths; a pad name or vN(x,y) marks a point on that pad's centre or on a via; arc(x,y) is an arc through that point)
GND: length 124.3
  Top Layer w0.254: LED1.C 18.69,29.59 ; v1(50.24,12.75) 50.24,13.55 49.55,14.24
  Top Layer w0.508: 18.05,15.89 12.88,15.89 D4.2
  Bottom Layer w0.254: U2.16 20.72,19.24 v1(20.97,19.49) ; R100.1 29.1,21.23 29.1,22.37 29.45,22.72 U3.13 29.45,25.54 29.72,25.81 29.97,25.81 29.99,25.8 30.62,25.8 31.4,25.02 U3.10 31.4,21.21 R101.1 ; v1(42.43,14.49) 42.5,14.43 C77.1 43.81,14.47 C78.1 ; v1(47.01,19.7) 46.26,18.95 U32.5 ; v1(47.01,19.7) 45.75,20.95 U32.12 ; v1(47.01,19.7) 47.26,19.95 47.26,21.64 ; v1(20.97,19.49) 21.61,19.49 21.86,19.24 21.86,18.9 22.45,18.31 22.85,18.31 U2.12 ; v1(20.97,19.49) 21.72,20.24 U2.5 ; U30.12 22.25,33.25 v1(21.93,33.57) v1(21,34.5) ; R103.2 36.72,21.32 36.72,22.5 37.23,23 U33.4 37.28,23.78 37.28,25.42 37.1,25.6 37.1,25.67 35.58,25.67 35.28,25.37 35.28,23.73 ; U31.5 46.26,34.06 v1(47.01,34.81) ; U30.5 21.75,35.25 v1(21,34.5) ; U30.16 20.75,34.25 v1(21,34.5) ; U3.1 28.8,31.74 R98.2 ; v1(47.01,34.81) 45.75,36.06 U31.12 ; v1(47.01,34.81) 47.26,35.06 U31.16 ; R98.2 32.12,32.84 R99.2 32.91,32.05 32.91,30.62 32.7,30.41 U3.7 32.7,28.55 33.16,28.08 38.27,28.08 38.53,28.34 U33.13 38.53,30.45 38.88,30.8 38.88,32.01 R104.1 39.78,32.77 v1(40.78,31.77) ; R98.2 30.75,31.99 U3.4 ; R98.2 29.86,32.88 29.86,39.13 29.22,39.77 C69.1 22.56,39.77 C68.1 ; C87.2 v1(50.24,12.75) C80.1 ; 36.59,28.59 36.59,29.56 U33.10 36.58,32.03 R105.1 ; R102.2 38.12,20.71 39.18,21.77 U33.1 39.18,24.61 39.13,24.65 ; C86.2 C81.1 ; v1(18.62,27.7) C82.1 C85.2 ; 28.59,25.03 27.07,25.03
  vias: v1(0.91,21.73) v1(1.54,76.34) v1(1.54,75.18) v1(2.81,76.34) v1(2.81,75.18) v1(3.82,29.59) v1(4.46,66.06) v1(4.84,36.97) v1(7.25,66.06) v1(10.43,45.36) v1(10.43,44.19) v1(10.62,51.07) v1(10.75,57.17) v1(10.68,55.19) v1(10.69,53.1) v1(11.57,45.36) v1(11.57,44.19) v1(15.08,40.89) v1(16.4,68.34) v1(18.56,21.61) v1(20.08,35.45) v1(20.08,20.34) v1(21.22,29.48) v1(21.22,28.31) v1(21.48,56.66) v1(21.86,18.69) v1(22.2,50.7) v1(22.7,41.29) v1(24.27,79.9) v1(24.27,78.73) v1(24.27,17.03) v1(24.27,15.87) v1(25.54,79.9) v1(25.54,78.73) v1(25.8,29.61) v1(25.8,28.44) v1(26.43,25.16) v1(26.43,24) v1(41.67,24.91) v1(42.84,24.91) v1(43.7,62.25) v1(43.7,61.08) v1(45.99,51.96) v1(45.99,50.79) v1(46.12,18.81) v1(46.26,33.83) v1(46.88,25.54) v1(47.9,35.7) v1(47.9,20.59) v1(48.04,25.54) v1(56.53,83.96) v1(56.53,82.8) v1(56.81,68.85) v1(56.81,67.68) v1(57.8,83.96) v1(57.8,82.8) v1(58.08,68.85) v1(58.08,67.68) v1(61.74,61.99) v1(61.74,60.83) v1(61.87,48.02) v1(61.87,46.86) v1(63.01,61.99) v1(63.01,60.83) v1(63.13,48.02) v1(63.13,46.86) v1(64.31,22.88) v1(64.6,28.42) v1(64.6,27.25) v1(65.8,78.38) v1(65.8,77.21) v1(67.07,78.38) v1(67.07,77.21) v1(67.07,20.34) v1(67.07,19.17) v1(67.22,34.69) v1(67.22,33.52) v1(67.2,27.83) v1(67.2,26.66) v1(67.2,15.38)
PGND: length 62.5
  Top Layer w0.254: U21.2 v1(36.47,66.31) ; C19.1 39.7,63.32 v1(39.13,62.75) ; 28.65,51.7 v1(28.65,53.09) 28.65,53.98 C3.2 ; R15.1 25.7,58.58 C16.1 ; 32.4,52.59 32.4,52.77 32.11,53.06 32.11,53.35 U12.3
  Top Layer w0.381: U12.3 31.96,54.3 U12.9 ; v1(30.95,54.63) 29.02,54.63 C3.2
  Top Layer w0.508: R15.1 22.79,58.58 C26.2 ; C30.2 32.45,64.41 C28.2 33.68,65.64 R18.1 ; C17.1 26.43,64.91 27.07,64.28 27.07,62.76 27.1,62.72
  Bottom Layer w0.254: 54.78,19.73 55.87,19.73 56.02,19.57 56.02,18.8 55.7,18.48 52.53,18.48 50.57,20.43 48.94,20.43 ; U2.20 18.95,18.81 17.22,18.81 15.44,20.59 12.08,20.59 11.83,20.34 11.83,19.7 12.08,19.45 R95.1 ; U30.20 18.66,33.75 18.51,33.89 17.43,33.89 15.62,35.7 12.21,35.7 11.95,35.44 11.95,34.71 12.21,34.46 13.21,34.46 ; 48.94,35.55 49.58,35.55 49.7,35.42 50.71,35.42 52.44,33.69 55.79,33.69 56.08,33.98 56.08,34.63 55.87,34.84 54.78,34.84
  vias: v1(5.35,2.43) v1(5.35,1.26) v1(6.62,2.43) v1(6.62,1.26) v1(13.35,34.78) v1(13.35,33.96) v1(13.35,19.88) v1(13.35,19.07) v1(13.86,2.56) v1(13.86,1.39) v1(13.99,28.59) v1(14.66,34.78) v1(14.66,33.96) v1(14.66,19.88) v1(14.66,19.07) v1(15.13,2.56) v1(15.13,1.39) v1(15.98,33.96) v1(15.98,19.07) v1(18.43,9.79) v1(18.43,8.63) v1(19.7,9.79) v1(19.7,8.63) v1(23.76,9.67) v1(23.76,8.5) v1(23.76,3.57) v1(23.76,2.41) v1(25.03,9.67) v1(25.03,8.5) v1(25.03,3.57) v1(25.03,2.41) v1(25.54,55.67) v1(25.54,54.5) v1(26.81,55.67) v1(26.81,54.5) v1(29.73,17.41) v1(32.02,38.88) v1(32.27,54.63) v1(32.8,65.09) v1(34.31,51.7) v1(36.72,17.16) v1(38.7,52.46) v1(51.96,35.32) v1(52,20.08) v1(51.96,2.81) v1(51.96,1.64) v1(52.97,26.56) v1(53.23,2.81) v1(53.23,1.64) v1(53.27,35.32) v1(53.27,34.51) v1(53.31,20.08) v1(53.31,19.27) v1(54.58,35.32) v1(54.58,34.51) v1(54.63,20.08) v1(54.63,19.27) v1(59.31,2.78) v1(59.31,1.61) v1(60.57,2.78) v1(60.57,1.61)
VCC3V3: length 17.2
  Top Layer w0.254: R28.2 64.41,33.81 v1(64.41,34.47) ; v1(64.41,40.28) 64.41,39.58 R27.2 ; R42.2 v1(64.02,52.21) ; 64.42,25.41 R29.2 v1(64.42,26.08) ; 64.39,19.69 R30.2 v1(64.4,20.37) ; v1(54.12,79.32) R20.1 ; v1(63.99,43.31) 63.23,43.31 63.19,43.35 ; R16.2 52.72,40.03 v1(52.72,45.1)
  Top Layer w0.381: 23.85,63.07 23.77,62.99
  Bottom Layer w0.254: U13.2 v2(4.21,32.44) ; U7.2 v2(4.21,17.32) ; U15.2 v2(63.77,36.94) ; U14.2 v2(63.77,21.82)
  vias: v1(20.09,67.45) v1(20.09,66.12) v1(20.09,64.79) v1(20.09,63.45) v1(20.09,62.12) v1(20.97,67.45) v1(20.97,66.12) v1(20.97,64.79) v1(20.97,63.45) v1(20.97,62.12) v1(21.78,67.45) v1(21.78,66.12) v1(21.78,64.79) v1(21.78,63.45) v1(21.78,62.12)
VCC5V: length 27.1
  Top Layer w0.762: 29.1,63.26 29.1,64.91 25.16,68.85 20.46,68.85 19.45,69.87 19.45,78.88 18.69,79.64 U26.6 U26.5
VCC5V_EXT: length 20.9
  Top Layer w0.254: v1(53.36,44.34) 53.36,44.33 R17.2
  Bottom Layer w0.254: v1(58.62,57.93) 58.62,55.44 53.36,50.18 v1(53.36,44.34)
  vias: v1(20.97,75.71) v1(20.97,74.37) v1(20.97,73.04) v1(20.97,71.71) v1(20.97,70.37) v1(21.78,75.71) v1(21.78,74.37) v1(21.78,73.04) v1(21.78,71.71) v1(21.78,70.37) v1(42.65,75.71) v1(42.65,74.37) v1(42.65,73.04) v1(42.65,71.71) v1(42.65,70.37) v1(43.46,75.71) v1(43.46,74.37) v1(43.46,73.04) v1(43.46,71.71) v1(43.46,70.37)
VCCBAT: length 6.6
  Top Layer w0.508: R89.1 6.87,12.97
  Bottom Layer w0.381: 23.74,41.42 v2(24.78,41.42) ; D6.1 43.98,13.14 v2(43.19,13.14) ; D5.1 v2(43.19,28) ; D3.1 v2(24.78,26.31)
  vias: v1(6.4,11.56) v1(6.4,9.91) v1(6.4,8.27) v1(6.4,6.63) v1(6.4,4.98) v1(7.89,11.56) v1(7.89,9.91) v1(7.89,8.27) v1(7.89,6.63) v1(7.89,4.98) v1(9.38,11.56) v1(9.38,9.91) v1(9.38,8.27) v1(9.38,6.63) v1(9.38,4.98) v1(11.06,37.48) v1(11.14,22.45) v1(12.02,37.48) v1(12.09,22.45) v1(12.97,37.48) v1(13.04,22.45) v1(13.1,31.89) v1(13.1,17.03) v1(13.92,37.48) v1(14.05,31.89) v1(13.99,22.45) v1(14.05,17.03) v1(14.87,37.48) v1(14.94,22.45) v1(15,31.89) v1(15,17.03) v1(15.95,31.89) v1(15.95,17.03) v1(16.91,31.89) v1(16.91,17.03) v1(26.56,50.56) v1(26.56,49.75) v1(27.89,50.56) v1(27.89,49.75) v1(29.23,50.56) v1(29.23,49.75) v1(30.24,7.76) v1(30.24,6.12) v1(30.24,4.47) v1(30.56,50.56) v1(30.56,49.75) v1(31.73,7.76) v1(31.73,6.12) v1(31.73,4.47) v1(31.73,2.83) v1(31.73,1.19) v1(31.89,50.56) v1(31.89,49.75) v1(33.22,7.76) v1(33.22,6.12) v1(33.22,4.47) v1(33.22,2.83) v1(33.22,1.19) v1(34.71,7.76) v1(34.71,6.12) v1(34.71,4.47) v1(34.71,2.83) v1(34.71,1.19) v1(36.19,7.76) v1(36.19,6.12) v1(36.19,4.47) v1(36.19,2.83) v1(36.19,1.19) v1(37.68,7.76) v1(37.68,6.12) v1(37.68,4.47) v1(37.68,2.83) v1(37.68,1.19) v1(51.13,37.35) v1(51.07,22.11) v1(52.02,22.11) v1(52.08,37.35) v1(53.03,37.35) v1(52.97,22.11) v1(53.23,31.77) v1(53.23,16.65) v1(53.93,22.11) v1(53.99,37.35) v1(54.18,31.77) v1(54.18,16.65) v1(54.94,37.35) v1(54.88,22.11) v1(55.13,31.77) v1(55.13,16.65) v1(56.09,31.77) v1(56.09,16.65) v1(57.04,31.77) v1(57.04,16.65) v1(58.98,11.69) v1(58.98,10.04) v1(58.98,8.4) v1(58.98,6.75) v1(58.98,5.11) v1(60.47,11.69) v1(60.47,10.04) v1(60.47,8.4) v1(60.47,6.75) v1(60.47,5.11) v1(61.96,11.69) v1(61.96,10.04) v1(61.96,8.4) v1(61.96,6.75) v1(61.96,5.11)
B3: length 42.6
  Top Layer w0.254: v1(20.84,50.64) 20.84,52.72 18.3,55.26 18.06,55.26 18.04,55.27 14.65,55.27 14.64,55.26 11.57,55.26 10.1,56.73 10.1,71.21 v1(10.28,71.39)
  Bottom Layer w0.254: CN1.6 9.67,77.36 8.41,76.1 8.41,71.88 8.91,71.39 v1(10.28,71.39) ; U26.38 22.7,48.78 v1(20.84,50.64)
B4: length 38.1
  Top Layer w0.254: CN1.10 9.7,72.76 9.7,55.23 11.95,52.97 18.81,52.97 20.08,51.7 v1(20.08,50.56)
  Bottom Layer w0.254: 22.7,44.08 21.48,45.3 21.48,49.17 v1(20.08,50.56)
B5: length 24.1
  Top Layer w0.254: U26.36 20.16,47.06 19.32,47.89 10.18,47.89 8.88,49.19 8.88,55.52 8.38,56.02 5.73,56.02 J1.12
B12: length 42.1
  Top Layer w0.254: v1(39.67,37.89) 34.87,37.89 34.56,38.19 34.56,42.56 v1(34.31,42.81)
  Bottom Layer w0.254: R108.1 40.38,37.89 v1(39.67,37.89) ; 12.02,51.32 12.92,51.32 U26.29 13.73,47.82 13.73,43.83 14.51,43.06 34.06,43.06 v1(34.31,42.81)
B14: length 70.5
  Top Layer w0.254: 14.7,52.09 U26.27 ; v1(33.89,42.15) 34.15,41.89 34.15,16.4 34.79,15.76 v1(39.39,15.76)
  Bottom Layer w0.254: v1(33.89,42.15) 33.39,42.65 14.34,42.65 13.33,43.66 13.33,47.13 10.12,50.34 10.1,50.34 9.94,50.5 9.94,50.52 9.92,50.54 9.92,51.7 10.3,52.09 11.32,52.09 12.02,52.79 C99.2 13.68,53.1 U26.27 ; R109.1 v1(39.39,15.76)
B15: length 74.9
  Top Layer w0.254: v1(28.59,15.76) 33.16,15.76 33.75,16.35 33.75,41.22 v1(33.5,41.47)
  Bottom Layer w0.254: 12.08,54.94 C97.2 ; 12.08,54.94 12.08,54.88 11.45,54.25 9.92,54.25 9.34,53.66 9.34,50.53 9.94,49.93 9.95,49.93 12.92,46.96 12.92,43.49 14.17,42.24 32.97,42.24 33.5,41.72 v1(33.5,41.47) ; 12.08,54.94 12.53,55.39 16.47,55.39 U26.26 ; R107.1 v1(28.59,15.76)
B17: length 37.3
  Top Layer w0.254: v1(18.94,45.36) 18.94,40.17 19.6,39.51 28.34,39.51 28.72,39.13 v1(28.72,37.99)
  Bottom Layer w0.254: v1(18.94,45.36) 18.94,55.46 U26.24 16.35,58.06 12.46,58.06 12.02,57.61 12.02,56.78 ; v1(28.72,37.99) 27.82,37.99 R106.1
B18: length 32.2
  Top Layer w0.254: CN1.3 5.6,78.88 5.6,77.23 6.3,76.53 10.37,76.53 10.86,76.04 10.86,58.26 12.33,56.78 U26.23
B19: length 26.8
  Top Layer w0.254: U26.22 16.22,60.72 12.84,60.72 11.68,61.89 11.68,78.72 11.45,78.95 11.45,79.42 10.45,80.41 CN1.4
B20: length 27.6
  Top Layer w0.254: CN1.5 8.4,79.14 10.68,79.14 11.27,78.55 11.27,60.26 12.46,59.07 14.82,59.07 U26.21
B21: length 29.1
  Top Layer w0.254: CN1.1 8.4,81.68 10.68,81.68 12.08,80.28 12.08,63.39 12.46,63.01 16.27,63.01 17.41,61.86 U26.20
B27: length 23.5
  Top Layer w0.254: U26.14 19.07,68.04 19.07,55.64 20.21,54.5 23.13,54.5 23.63,54 R53.1 23.63,51.89 C20.2 25.04,51.83 R51.2
B28: length 27.4
  Bottom Layer w0.254: J1.6 5.73,50.94 7.64,50.94 8.8,52.11 8.8,66.46 9.52,67.17 13.13,67.17 15.08,69.12 U26.13
B29: length 28.1
  Bottom Layer w0.254: U26.12 17.29,72.03 16.02,73.3 14.37,73.3 13.96,72.89 13.96,70.72 12.43,69.18 3.21,69.18 2.84,68.81 2.84,61.46 J1.14
B30: length 27.4
  Bottom Layer w0.254: 4.46,52.21 5.33,52.21 6.6,53.48 7.64,53.48 8.4,54.25 8.4,66.63 9.35,67.58 12.96,67.58 13.58,68.2 13.58,69.76 15.08,71.26 U26.11
B31: length 30.4
  Top Layer w0.254: v1(12.67,68.39) 12.67,72.36 13.61,73.3 16.35,73.3 U26.10
  Bottom Layer w0.254: v1(12.67,68.39) 6.67,68.39 5.82,67.54 5.82,56.11 J1.10
C0: length 53.1
  Top Layer w0.254: U26.78 51.38,69.48 56.56,64.3 66.04,64.3 67.4,62.94 67.4,51.65 65.29,49.55 65.29,45.04 67.2,43.14 v1(67.2,39.39)
  Bottom Layer w0.254: U15.4 62.95,33.94 64.07,35.06 65.16,35.06 65.93,35.83 65.93,38.01 67.2,39.28 v1(67.2,39.39)
C1: length 53
  Top Layer w0.254: v1(66.44,39.39) 66.44,43.32 64.89,44.87 64.89,49.83 67,51.93 67,62.77 65.87,63.9 56.4,63.9 52.14,68.15 49.43,68.15 U26.77
  Bottom Layer w0.254: v1(66.44,39.39) 65.42,38.37 65.42,37.13 65.05,36.76 64.53,36.76 63.34,35.58 62.54,35.58 U15.3
C2: length 66.3
  Top Layer w0.254: v1(65.42,18.82) 66.06,19.46 66.06,38.5 65.8,38.75 65.8,43.38 64.48,44.7 64.48,49.99 66.59,52.1 66.59,62.6 65.8,63.39 56.28,63.39 52.72,66.94 50.64,66.94
  Bottom Layer w0.254: U14.4 v1(65.42,18.82)
C3: length 66.3
  Top Layer w0.254: 48.1,66.94 49.37,65.67 53.42,65.67 56.11,62.98 65.63,62.98 66.18,62.43 66.18,52.27 64.07,50.16 64.07,44.54 65.4,43.22 65.4,38.58 65.65,38.33 65.65,21.22 65.39,20.96 v1(65.09,20.96)
  Bottom Layer w0.254: U14.3 63.12,20.32 63.76,20.96 v1(65.09,20.96)
C5: length 13.9
  Top Layer w0.254: U26.73 48.66,64.41 50.05,63.01 53,63.01 55.01,61 55.01,60.98 55.19,60.8 57.98,60.8 59.58,59.2 U25.4
C6: length 9.4
  Top Layer w0.254: U26.72 51.4,61.1 53.42,61.1 55.77,58.76 55.77,57.67 56.78,56.66 U25.1
C7: length 16.8
  Top Layer w0.254: U26.71 48.35,61.61 48.53,61.61 49.56,60.58 53.37,60.58 55.36,58.59 55.36,56.18 56.53,55.01 58.44,55.01 59.83,56.4 U25.3
C8: length 26.3
  Top Layer w0.254: U26.70 53.61,59.33 54.96,57.98 54.96,54.35 56.56,52.75 56.56,41.01 57.93,39.64 59.64,39.64 R47.2
C9: length 33
  Top Layer w0.254: R48.2 59.36,33.8 58.31,34.84 58.31,38.68 56.15,40.84 56.15,52.58 54.55,54.19 54.55,57.11 53.48,58.18 49.8,58.18 48.66,59.33 U26.69
C10: length 45.6
  Top Layer w0.254: v1(45.48,56.78) 45.48,78.5 44.34,79.64 33.04,79.64 30.19,82.49 P5.3
  Bottom Layer w0.254: U26.68 49.37,55.52 45.99,55.52 45.48,56.02 v1(45.48,56.78)
C11: length 33.3
  Top Layer w0.254: P5.6 39.77,80.86 44.84,80.86 46.7,79.01 46.7,58.18 U26.67
C12: length 44.9
  Top Layer w0.254: P5.4 35.5,80.05 44.51,80.05 45.89,78.67 45.89,57.84 46.07,57.66 46.07,54.17 47.13,53.1 49.49,53.1 U26.66
C13: length 38
  Top Layer w0.254: U26.65 46.47,55.87 46.47,57.83 46.29,58 46.29,78.84 44.68,80.46 37.63,80.46 P5.5
C14: length 32.6
  Top Layer w0.254: U26.64 54.93,51.7 55.74,50.89 55.74,40.67 57.9,38.52 57.9,34.21 58.82,33.29 58.82,26.34 R49.2
C15: length 39.9
  Top Layer w0.254: R50.2 58.41,21 58.41,33.13 57.5,34.04 57.5,38.35 55.34,40.51 55.34,49.67 54.57,50.44 49.37,50.44 U26.63
C21: length 60.3
  Top Layer w0.254: 50.64,44.08 49.42,45.3 49.42,47.39 48.91,47.89 47.39,47.89 46.62,48.66 20.34,48.66 18.59,50.4 9.95,50.4 9.29,51.07 9.29,60.21 8.49,61.01 5.82,61.01 J1.16
C28: length 10.8
  Top Layer w0.254: U26.52 41.8,45.3 41.8,43.58 43.32,42.05 45.8,42.05 R58.2
C29: length 7
  Top Layer w0.254: 40.48,44.08 43.02,41.55 44.46,41.55 45.74,40.27 R57.1
C30: length 10.2
  Top Layer w0.254: U26.50 39.26,45.3 39.26,43.27 41.39,41.14 43.42,41.14 44.29,40.27 R56.2
C31: length 6.5
  Top Layer w0.254: R55.1 42.62,40.28 41.42,40.28 37.94,43.76 37.94,44.08
CR: length 35
  Top Layer w0.254: U21.4 v1(35.51,63.9) ; U19.5 v1(29.4,61.12)
  Bottom Layer w0.254: U26.9 15.64,74.56 16.78,73.42 18.69,73.42 19.65,72.46 25.62,72.46 28.46,69.61 28.46,61.7 29.04,61.12 v1(29.4,61.12) 34.7,61.12 35.58,61.99 35.58,63.84 v1(35.51,63.9)
D0: length 35.5
  Bottom Layer w0.254: U26.48 35.4,50 36.62,51.22 39.54,51.22 40.25,51.93 40.25,69.51 39.13,70.63 34.93,70.63 H3.3
D1: length 36.1
  Bottom Layer w0.254: 35.4,44.08 36.59,45.28 36.59,50.44 36.97,50.82 39.71,50.82 40.66,51.77 40.66,69.74 39,71.39 36.71,71.39 H3.4
D2: length 34.5
  Top Layer w0.254: v1(34.56,50.18) v1(37.18,50.18)
  Bottom Layer w0.254: U26.46 32.86,48.99 34.05,50.18 v1(34.56,50.18) ; v1(37.18,50.18) 39.65,50.18 41.06,51.6 41.06,70.09 38.32,72.83 H3.5
D3: length 35.6
  Top Layer w0.254: v1(37.18,49.42) v1(34.56,49.42)
  Bottom Layer w0.254: 32.86,44.08 34.18,45.41 34.18,49.04 v1(34.56,49.42) ; v1(37.18,49.42) 39.46,49.42 41.47,51.43 41.47,71.71 H3.6
D4: length 11.2
  Top Layer w0.254: U26.44 28.97,45.28 28.97,43.6 27.45,42.08 24.04,42.08 23.51,41.55 R62.2
D5: length 6.7
  Top Layer w0.254: 30.32,44.08 27.78,41.55 26.44,41.55 R61.1
D6: length 11.5
  Top Layer w0.254: U26.42 27.78,46.32 26.56,45.1 26.56,43.7 25.75,42.89 22.7,42.89 21.16,41.35 20.65,41.35 20.34,41.04 20.34,40.32 R60.2
D7: length 8.2
  Top Layer w0.254: 27.78,44.08 26.18,42.48 22.87,42.48 21.92,41.54 R59.1
D8: length 46.9
  Top Layer w0.254: v1(57.8,52.09) 58.46,52.09 R24.2 ; v1(51.95,42.94) 47.49,42.94 46.88,43.55 46.88,47.26 45.99,48.15 26.76,48.15 U26.40
  Bottom Layer w0.254: v1(57.8,52.09) 57.42,52.09 57.17,51.83 57.17,43.64 56.46,42.94 v1(51.95,42.94)
D9: length 40.6
  Top Layer w0.254: v1(57.8,43.32) R46.2 ; 25.24,44.08 25.24,44.59 26.43,45.78 26.43,47.13 26.95,47.65 43.69,47.65 44.34,47.01 44.34,43.7 45.23,42.81 46.62,42.81 47.26,42.18 v1(51.96,42.18)
  Bottom Layer w0.254: v1(51.96,42.18) 56.28,42.18 57.42,43.32 v1(57.8,43.32)
D13: length 99.1
  Bottom Layer w0.254: U13.4 4.35,35.44 4,35.78 4,40.72 2.74,41.99 1.86,41.99 1.59,42.26 1.59,69.41 2.58,70.4 11.92,70.4 12.74,71.22 12.74,79.15 14.51,80.92 18.56,80.92 19.02,81.37 19.02,83.28 20.63,84.9 46.19,84.9 47.51,83.58 49.49,83.58 U26.90
D14: length 98.2
  Bottom Layer w0.254: U26.89 47.51,85.31 20.47,85.31 18.85,83.7 15,83.7 12.33,81.03 12.33,71.39 11.75,70.81 2.41,70.81 1.16,69.55 1.16,42.05 1.63,41.58 2.57,41.58 3.6,40.56 3.6,34.53 4.21,33.92 5.56,33.92 U13.3
D15: length 113.1
  Top Layer w0.254: v1(3.19,20.46) 2.81,20.84 v1(2.81,43.83)
  Bottom Layer w0.254: v1(2.81,43.83) 2.43,44.21 2.43,68.98 3.04,69.59 12.26,69.59 13.55,70.89 13.55,75.02 14.37,75.83 18.18,75.83 19.83,77.49 19.83,82.95 20.97,84.09 44.34,84.09 47.39,81.04 49.49,81.04 U26.88 ; U7.4 5.43,20.46 v1(3.19,20.46)
D16: length 112.5
  Top Layer w0.254: v1(2.68,18.81) 2.2,19.3 v1(2.2,43.29)
  Bottom Layer w0.254: v1(2.2,43.29) 2.2,43.87 2.02,44.04 2.02,69.15 2.87,69.99 12.09,69.99 13.15,71.05 13.15,77.02 14.51,78.38 18.3,78.38 19.42,79.49 19.42,83.12 20.8,84.5 45.79,84.5 U26.87 ; U7.3 5.56,18.81 v1(2.68,18.81)
D20: length 23.1
  Top Layer w0.254: CN2.4 64.27,66.06 59.55,70.78 59.55,73.82 57.54,75.83 49.37,75.83 U26.83
D21: length 17.8
  Top Layer w0.254: CN2.3 62.35,67.4 59.15,70.61 59.15,73.66 58.24,74.56 U26.82
D24: length 18
  Top Layer w0.254: R19.1 v1(63.71,70.88) R13.2
  Bottom Layer w0.254: U26.79 49.24,70.88 v1(63.71,70.88)
L_B_A: length 9.3
  Bottom Layer w0.254: U2.23 17.57,20.24 15.64,22.17 15.64,23.77 15.13,24.27 13.03,24.27 13.03,24.96
L_B_B: length 11.5
  Bottom Layer w0.254: 11.13,14.19 11.13,15.32 11.6,15.79 19.45,15.79 19.7,16.05 19.7,17.53 U2.18
L_B_EN: length 18.7
  Bottom Layer w0.254: 30.75,23.73 30.75,15.89 29.86,15 23.51,15 21.72,16.79 U2.14
L_B_EN_IN: length 23.6
  Top Layer w0.254: R60.1 21.18,37.86 22.6,37.86 23.42,37.05 25.21,37.05 26.23,36.03 28.01,36.03 29.1,34.94 29.1,28.59 30.1,27.59 v1(30.1,24.78)
  Bottom Layer w0.254: 30.16,22.19 30.1,22.25 U3.12 v1(30.1,24.78)
L_B_PH: length 21
  Bottom Layer w0.254: 32.7,23.73 32.7,23.08 33.04,22.75 33.04,19.85 31.16,17.97 31.16,15.72 30.03,14.6 23.34,14.6 21.22,16.72 U2.15
L_B_PH_IN: length 23.2
  Top Layer w0.254: R59.2 22.28,38.76 23.59,37.46 25.44,37.46 26.46,36.44 28.23,36.44 29.53,35.14 29.53,28.79 32.02,26.31 v1(32.02,24.78)
  Bottom Layer w0.254: v1(32.02,24.78) 32.02,23.64 U3.9 32.05,22.32 32.19,22.18
L_DVDD: length 9.4
  Bottom Layer w0.254: U2.8 23.92,20.24 24.27,20.59 C71.2 24.53,22.94 28.59,22.94 28.8,23.15 28.8,23.73
L_F_A: length 9.1
  Bottom Layer w0.254: 13.19,39.97 13.19,39.39 15.13,39.39 15.64,38.88 15.64,37.41 17.8,35.25 19.18,35.25
L_F_B: length 11.5
  Bottom Layer w0.254: U30.18 19.73,32.54 19.73,31.06 19.48,30.8 11.63,30.8 11.16,30.33 11.16,29.2
L_F_EN: length 12.3
  Bottom Layer w0.254: U30.14 21.75,31.88 22.11,31.51 27.07,31.51 27.68,30.9 27.68,29.12 28.21,28.59 29.86,28.59 30.12,28.84 30.12,29.57 30.1,29.58
L_F_EN_IN: length 15.4
  Top Layer w0.254: v1(30.12,30.5) 30.12,35.13 28.4,36.85 26.63,36.85 25.61,37.86 24.41,37.86 R62.1
  Bottom Layer w0.254: R98.1 30.12,31.12 v1(30.12,30.5) ; 29.45,29.58 29.45,30.63 29.9,31.08
L_F_PH: length 15.4
  Bottom Layer w0.254: 32.05,29.58 32.05,28.88 31.13,27.96 28.08,27.96 27.27,28.77 27.27,30.73 26.9,31.11 21.95,31.11 21.25,31.8 U30.15
L_F_PH_IN: length 15.1
  Top Layer w0.254: R61.2 25.29,38.76 26.8,37.25 28.57,37.25 30.6,35.22 30.6,32.77 32.15,31.22 32.15,30.62 v1(32.02,30.5)
  Bottom Layer w0.254: v1(32.02,30.5) 32.19,30.67 32.19,31.01 ; 32.19,31.01 31.9,31.01 31.4,30.51 31.4,29.58 ; 32.19,31.01 R99.1
MOTOR_3V3: length 17.8
  Top Layer w0.508: U5.6 6.83,21.22 5.35,21.22 4.72,21.86 R92.2 ; U5.6 6.87,16.77 R89.2 8.35,16.77 D4.1 ; U5.6 U5.3
NSLEEP: length 74.1
  Top Layer w0.254: 23.26,28.23 19.95,24.92 R93.1 ; 23.26,28.23 v1(23.26,17.55) ; 23.26,28.23 v1(23.26,32.56) ; v1(44.59,36.76) v1(44.59,26.49) v1(44.59,21.64)
  Top Layer w0.508: R93.1 14.12,24.92 U5.2 U5.5
  Bottom Layer w0.254: U2.13 v1(23.26,17.55) ; U30.13 v1(23.26,32.56) ; v1(23.89,28.08) 23.94,28.08 25.53,26.49 v1(44.59,26.49) ; 45.76,21.64 v1(44.59,21.64) ; U31.13 v1(44.59,36.76)
R_B_A: length 9.2
  Bottom Layer w0.254: 54.93,14.21 54.93,14.75 52.85,14.75 52.21,15.38 52.21,17.03 50.31,18.93 48.94,18.93
R_B_B: length 11.5
  Bottom Layer w0.254: 48.24,21.63 48.26,21.64 48.26,23.13 48.51,23.38 56.35,23.38 56.83,23.85 56.83,24.98
R_B_EN: length 19.7
  Bottom Layer w0.254: U33.6 35.93,23.1 35.44,22.62 35.28,22.62 34.63,21.97 34.63,19.63 35.35,18.91 38.67,18.91 38.72,18.96 38.78,18.96 39.62,19.8 39.62,20.69 41.7,22.77 45.84,22.77 46.26,22.36 46.26,21.64
R_B_EN_IN: length 25.8
  Top Layer w0.254: R58.1 46.41,37.58 44.26,37.58 43.85,37.18 42.33,37.18 41.19,36.03 39.79,36.03 39.14,35.38 39.14,24.91 38.88,24.65 v1(36.59,24.65)
  Bottom Layer w0.254: 35.83,22.19 36.58,22.94 U33.5 36.59,23.74 v1(36.59,24.65)
R_B_PH: length 17.3
  Bottom Layer w0.254: U33.3 37.88,23.02 37.23,22.37 37.23,19.57 37.48,19.32 38.5,19.32 39.13,19.95 39.13,20.91 41.36,23.13 41.48,23.13 41.53,23.18 46.01,23.18 46.06,23.13 46.12,23.13 46.76,22.49 46.76,21.64
R_B_PH_IN: length 22.1
  Top Layer w0.254: v1(38.55,25.24) 38.64,25.33 38.64,35.46 39.62,36.44 41.02,36.44 42.16,37.58 43.69,37.58 44.09,37.99 45.16,37.99 R57.2
  Bottom Layer w0.254: 38.12,22.2 38.53,22.61 U33.2 38.53,25.21 v1(38.55,25.24)
R_DVDD: length 9.7
  Bottom Layer w0.254: U31.8 44.05,34.06 43.7,33.71 43.7,31.11 ; C76.2 39.78,31.01 39.18,30.41 U33.14
R_F_A: length 9.3
  Bottom Layer w0.254: 48.94,34.05 50.25,34.05 52.32,31.98 52.32,30.39 52.72,29.99 54.93,29.99 54.93,29.33
R_F_B: length 11.5
  Bottom Layer w0.254: 56.83,40.1 56.83,38.96 56.35,38.49 48.51,38.49 48.26,38.24 U31.18 48.24,36.74
R_F_EN: length 18.7
  Bottom Layer w0.254: U33.11 37.23,37.61 38.22,38.6 45.25,38.6 46.26,37.6 U31.14
R_F_EN_IN: length 13.9
  Top Layer w0.254: 38.12,30.75 38.01,30.85 38.01,35.41 39.45,36.85 40.85,36.85 41.99,37.99 43.52,37.99 R56.1
  Bottom Layer w0.254: U33.12 37.88,30.77 38.12,31.01
  vias: v1(38.06,30.81)
R_F_PH: length 21
  Bottom Layer w0.254: 35.28,29.58 35.32,29.62 35.32,30.5 35.07,30.75 35.07,33.92 36.82,35.68 36.82,37.78 38.05,39 45.42,39 46.66,37.76 46.66,37.69 46.76,37.6 U31.15
R_F_PH_IN: length 13.5
  Top Layer w0.254: R55.2 42.19,38.76 40.73,37.3 39.34,37.3 37.61,35.58 37.61,32.33 v1(35.91,30.62)
  Bottom Layer w0.254: U33.9 35.91,29.6 v1(35.91,30.62) 35.83,30.7 35.83,31.01
$1N1623: length 11.6
  Top Layer w0.508: R1.2 49.03,5.98 D1.2 47.26,10.56 46.62,11.19 SW2.3
$1N1624: length 7.5
  Top Layer w1.016: Q1.1 37.42,9.86 40.78,6.49 SW2.2
$1N1626: length 20.5
  Top Layer w0.508: SW2.1 42.56,1.67 46.12,1.67 47.26,2.81 D1.1
  Bottom Layer w0.762: 34.31,10.56 34.56,10.3 38.12,10.3 39.51,8.91 39.51,4.84 42.43,1.92 SW2.1
  vias: v1(34.31,11.86) v1(34.31,10.99) v1(34.31,10.13) v1(34.31,9.26)
$1N1630: length 2.2
  Top Layer w0.508: C3.1 28.74,55.75 30.66,55.75
$1N1632: length 3.1
  Top Layer w0.381: R4.2 32.03,57.42 ; 32.09,57.36 32.16,57.42 ; 31.96,55.75 31.96,57.23
$1N1633: length 3.3
  Top Layer w0.254: R2.2 31.31,58.77 31.31,55.75
$1N1635: length 5.5
  Top Layer w0.254: U19.6 29.57,61.77 29.98,61.36 29.98,60.88 29.64,60.54 28.53,60.54 27.94,59.94 27.94,59.07 C16.2
$1N1636: length 3.4
  Top Layer w0.254: R15.2 23.77,60.1 R14.1 24.06,61.77 U19.3
$1N1640: length 1.7
  Top Layer w0.254: 50.19,39.39 50.19,37.7 U20.1
$1N1643: length 1.9
  Top Layer w0.254: U22.1 56.02,38.23 55,39.26
$1N1646: length 1.6
  Top Layer w0.508: U21.3 35.51,66.49 R18.2
$2N2426: length 3.8
  Top Layer w0.254: R20.2 56.71,76.73 BUZZER1.1
$2N2427: length 5.5
  Top Layer w0.254: BUZZER1.2 62.63,77.57 62.63,74.18 63.26,73.55 Q10.3
$2N2428: length 1.9
  Top Layer w0.254: Q10.1 66.65,71.36
  Top Layer w0.508: 66.65,71.36 R13.1
$2N2453: length 5.2
  Top Layer w0.254: R42.1 R24.1 60.1,50.19 SW3.2
$2N2454: length 5.3
  Top Layer w0.254: SW3.1 60.1,45.35 R46.1 61.66,43.32 R43.1
$2N2458: length 4.3
  Top Layer w0.254: R47.1 R27.1 62.89,37.36 U8.1
$2N2459: length 4.3
  Top Layer w0.254: R48.1 R28.1 62.89,31.59 U9.1
$2N2460: length 4.3
  Top Layer w0.254: 61.25,25.42 R29.1 62.92,23.2 U10.1
$2N2461: length 4.3
  Top Layer w0.254: U11.1 62.89,17.49 R30.1 R50.1
$4N3957: length 4
  Bottom Layer w0.254: C69.2 24.27,38.31 24.27,36.08 23.44,35.25 U30.8
$4N3960: length 3.7
  Bottom Layer w0.254: 20.69,39.71 21.51,38.89 21.51,37.81 21.26,37.55 21.26,36.5 21.25,36.49
$4N3961: length 1.8
  Bottom Layer w0.254: 20.69,38.31 20.75,38.25 20.75,36.49
$4N3962: length 2.6
  Bottom Layer w0.254: 20.25,36.49 20.25,37.42 19.35,38.31 18.91,38.31
$4N3970: length 10.8
  Top Layer w0.254: v1(15.05,38.52) v1(16.25,38.52)
  Bottom Layer w0.254: U30.24 17.88,35.75 16.25,37.37 v1(16.25,38.52) ; v1(15.05,38.52) 11.86,38.52 11.16,39.22 11.16,39.97
$4N3971: length 10.9
  Bottom Layer w0.254: 9.76,37.97 9.76,37.45 10.61,36.59 15.88,36.59 17.63,34.84 17.64,34.84 17.73,34.75 U30.22
$4N3972: length 13.7
  Bottom Layer w0.254: U30.19 18.52,33.25 18.26,33 11.16,33 10.72,32.55 10.72,31.16 10.46,30.91 8.11,30.91 7.83,31.19 Q37.1
$4N3973: length 9.3
  Bottom Layer w0.254: U30.17 20.24,32.55 20.24,30.9 19.48,30.14 13.36,30.14 Q36.1
$4N3976: length 2
  Bottom Layer w0.254: C72.2 22.24,23.06 22.24,21.45 U2.6
$4N3977: length 3.7
  Bottom Layer w0.254: U2.4 21.22,21.44 21.22,22.5 21.48,22.75 21.48,23.83 C65.2
$4N3978: length 1.8
  Bottom Layer w0.254: U2.3 20.72,23.19 C65.1
$4N3979: length 2.6
  Bottom Layer w0.254: 18.88,23.26 19.32,23.26 20.22,22.36 U2.2
$4N3987: length 10.9
  Top Layer w0.254: v1(15.05,23.51) v1(16.22,23.51)
  Bottom Layer w0.254: U2.24 17.65,20.74 16.22,22.17 v1(16.22,23.51) ; 11.13,24.96 11.13,24.21 11.83,23.51 v1(15.05,23.51)
$4N3988: length 11
  Bottom Layer w0.254: 9.73,22.96 9.73,22.31 10.53,21.5 15.68,21.5 17.44,19.74 U2.22
$4N3989: length 13.5
  Bottom Layer w0.254: 7.83,16.19 7.83,16.05 8.08,15.79 10.43,15.79 10.68,16.05 10.68,17.8 11.13,18.24 U2.19
$4N3990: length 9.9
  Bottom Layer w0.254: 13.03,14.19 13.03,14.81 13.35,15.13 19.45,15.13 20.21,15.89 20.21,17.54 U2.17
$4N4012: length 1.7
  Top Layer w0.508: LED1.A R93.2
$4N4023: length 9.6
  Bottom Layer w0.381: 19.75,36.49 19.75,37.03 19.35,37.43 18.34,37.43 17.51,38.25 17.51,38.31 16.88,38.95 16.88,40.09 19.25,40.09 20.52,41.36
$4N4024: length 9.6
  Bottom Layer w0.381: U2.1 19.72,21.97 19.32,22.37 18.3,22.37 17.48,23.19 C73.2 16.84,23.89 C85.1 C82.2 19.22,25.03 D3.2
$4N4038: length 3.7
  Bottom Layer w0.254: 47.34,29.68 46.52,30.51 46.52,31.59 46.77,31.84 46.77,32.9 46.78,32.91
$4N4039: length 1.8
  Bottom Layer w0.254: 47.28,32.91 47.28,31.15 47.34,31.08
$4N4040: length 2.6
  Bottom Layer w0.254: 49.12,31.08 48.68,31.08 47.78,31.98 47.78,32.91
$4N4048: length 10.8
  Top Layer w0.254: v1(52.91,30.77) 52.9,30.78 v1(51.74,30.78)
  Bottom Layer w0.254: v1(51.74,30.78) 51.74,31.99 50.18,33.55 48.94,33.55 ; v1(52.91,30.77) 56.13,30.77 56.83,30.08 56.83,29.33
$4N4049: length 10.9
  Bottom Layer w0.254: 58.23,31.33 58.23,31.85 57.27,32.81 52.07,32.81 50.33,34.55 48.94,34.55
$4N4050: length 13.5
  Bottom Layer w0.254: 48.94,36.05 56.83,36.05 57.27,36.49 57.27,38.24 57.53,38.49 59.87,38.49 60.13,38.24 60.13,38.1
$4N4051: length 9.9
  Bottom Layer w0.254: 54.93,40.1 54.93,39.48 54.61,39.16 48.51,39.16 47.75,38.39 47.75,36.75 47.74,36.74
$4N4054: length 3.7
  Bottom Layer w0.254: 47.32,14.5 46.5,15.32 46.5,16.41 46.75,16.66 46.75,17.72 46.76,17.72
$4N4055: length 1.8
  Bottom Layer w0.254: 47.26,17.72 47.26,15.96 47.32,15.9
$4N4056: length 2.6
  Bottom Layer w0.254: 49.1,15.9 48.65,15.9 47.76,16.8 47.76,17.72
$4N4064: length 10.9
  Top Layer w0.254: v1(52.8,15.66) 52.78,15.68 v1(51.63,15.68)
  Bottom Layer w0.254: v1(51.63,15.68) 51.63,17.04 50.24,18.43 48.94,18.43 ; v1(52.8,15.66) 56.13,15.66 56.83,14.97 56.83,14.21
$4N4065: length 10.9
  Bottom Layer w0.254: 58.23,16.21 58.23,16.74 57.3,17.67 52.15,17.67 50.39,19.43 48.94,19.43
$4N4066: length 13.5
  Bottom Layer w0.254: 60.13,22.98 60.13,23.13 59.87,23.38 57.53,23.38 57.27,23.13 57.27,21.38 56.83,20.93 48.94,20.93
$4N4067: length 9.9
  Bottom Layer w0.254: 54.93,24.98 54.93,24.36 54.61,24.04 48.51,24.04 47.75,23.28 47.75,21.64 47.74,21.63
$4N4070: length 4
  Bottom Layer w0.254: U32.8 44.44,18.95 43.96,18.47 43.96,15.99 43.8,15.83
$4N4100: length 9.6
  Bottom Layer w0.381: 47.51,28.03 48.78,29.3 51.15,29.3 51.15,30.45 50.52,31.08 50.52,31.14 49.69,31.97 48.68,31.97 48.28,32.37 48.28,32.91
$4N4101: length 9.6
  Bottom Layer w0.381: 48.26,17.72 48.26,17.19 48.65,16.79 49.67,16.79 50.5,15.96 50.5,15.9 51.13,15.27 51.13,14.12 48.76,14.12 47.49,12.85
$4N4110: length 10.9
  Bottom Layer w0.254: 10.25,34.46 11.35,34.46 11.5,34.61 11.5,35.63 11.95,36.08 12.02,36.08 12.05,36.11 15.79,36.11 17.6,34.3 18.68,34.3 18.73,34.25 U30.21
$4N4111: length 10.6
  Bottom Layer w0.254: U2.21 17.37,19.24 15.61,21 11.91,21 11.42,20.5 11.42,19.7 11.17,19.45 R95.2
$4N4112: length 10.8
  Bottom Layer w0.254: 57.74,19.73 56.56,19.73 56.43,19.6 56.43,18.63 55.87,18.08 52.32,18.08 50.56,19.84 50.55,19.84 50.46,19.93 48.94,19.93
$4N4113: length 10.7
  Bottom Layer w0.254: 48.94,35.05 48.96,35.07 49.48,35.07 49.53,35.02 50.49,35.02 52.21,33.29 55.96,33.29 56.49,33.81 56.49,34.64 56.68,34.84 57.74,34.84
$4N4115: length 4.1
  Bottom Layer w0.254: U31.11 43.34,35.56 42.3,36.6 R108.2
$4N4121: length 2
  Bottom Layer w0.254: 45.78,32.91 45.76,32.88 45.76,31.27 45.5,31.02
$4N4129: length 2
  Bottom Layer w0.254: 45.48,15.84 45.73,16.09 45.73,17.7 45.76,17.72
